# EasyEDA Pro project ProPrj_Usb Hub_2026-05-24.epro

# Schematic Schematic1
Board Name: Board1; Create Date: 2026-05-18; Page Name: P1; Project Name: Usb; Schematic Name: Schematic1; Update Date: 2026-05-18; Company: EasyEDA.com; Page Size: A4; Version: V1.0
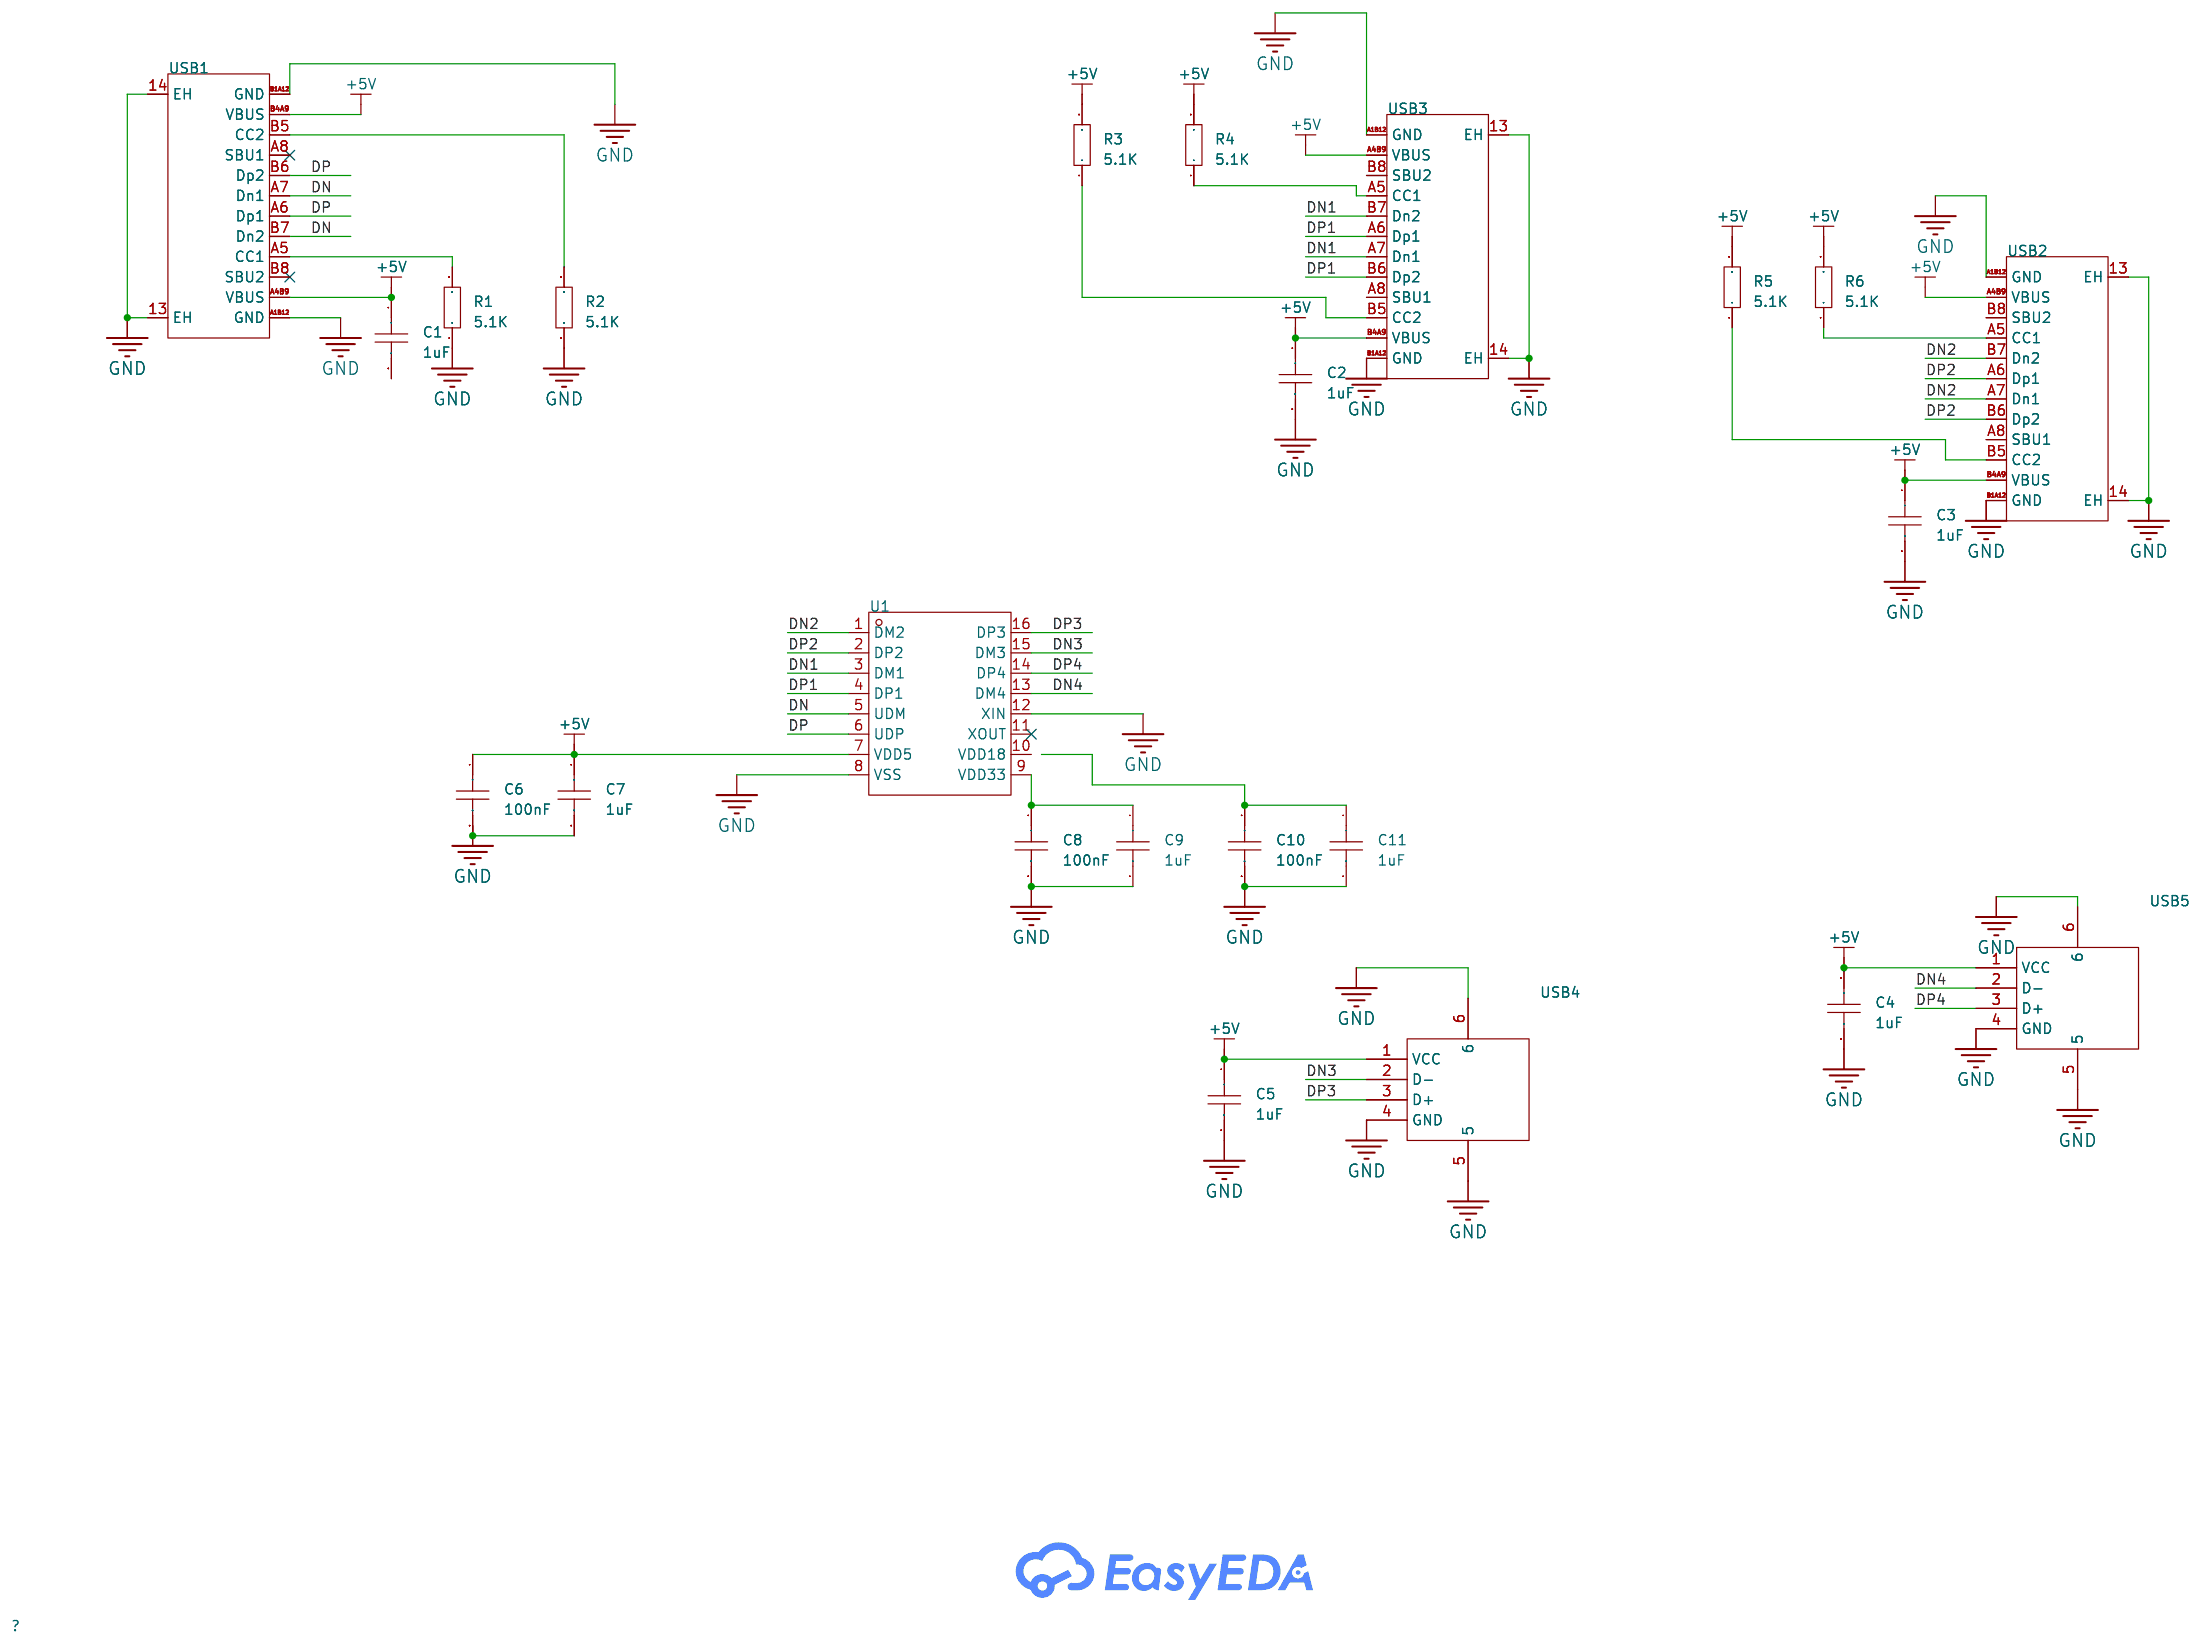
[diagram p0: schematic sheet]

## Parts
C1  1uF  [C0603]
C2  1uF  [C0603]
C3  1uF  [C0603]
C4  1uF  [C0603]
C5  1uF  [C0603]
C6  100nF  [C0603]
C7  1uF  [C0603]
C8  100nF  [C0603]
C9  1uF  [C0603]
C10  100nF  [C0603]
C11  1uF  [C0603]
R1  5.1K  [R0603]
R2  5.1K  [R0603]
R3  5.1K  [R0603]
R4  5.1K  [R0603]
R5  5.1K  [R0603]
R6  5.1K  [R0603]
U1  SL2.1s  [SSOP-16_L4.6-W2.6-P0.53-LS4.0-BL]
USB1  TYPE-C 16PIN 2MD(073)  [USB-C-SMD_TYPE-C-16PIN-2MD-073]
USB2  TYPE-C 16PIN 2MD(073)  [USB-C-SMD_TYPE-C-16PIN-2MD-073]
USB3  TYPE-C 16PIN 2MD(073)  [USB-C-SMD_TYPE-C-16PIN-2MD-073]
USB4  10.0 QHHTZB6.3  [USB-A-TH_10.0QHHTZB6.3]
USB5  10.0 QHHTZB6.3  [USB-A-TH_10.0QHHTZB6.3]

## Library data of the parts
C1-C11 = CAP_0603: Supplier Footprint: 0603
R1-R6 = Res_0603: Supplier Footprint: 0603
U1 = SL2.1s: type:Hub USB Protocol:USB 2.0 Data Rate:- Voltage - Supply:4V~5.25V Voltage - Supply:4V~5.25V Operating Temperature:0℃~+70℃ Operating Temperature:0℃~+70℃ Memory Interface:- Current - Supply:120mA Quiescent Supply Current:2.5mA Number of Channels:4; LCSC Part Name: USB2.0 HUB控制器集成电路; Supplier Part: C2684433; Manufacturer: CoreChips(和芯润德); Supplier Footprint: SSOP-16; JLCPCB Part Class: Extended Part; Datasheet: https://item.szlcsc.com/datasheet/SL2.1s/2782346.html; Supplier: LCSC; type: Hub; USB Protocol: USB 2.0; Voltage - Supply: 4V~5.25V; Operating Temperature: 0℃~+70℃; Current - Supply: 120mA; Quiescent Supply Current: 2.5mA; Number of Channels: 4
USB1-USB3 = TYPE-C 16PIN 2MD(073): Connector Type:Type-C Protocol Standard:- Gender:Female Mounting Type:Surface Mount, Right Angle Number of Contacts:16P Number of Ports:1 Current Rating-Power:3A Voltage Rating:5V Connect-Disconnect Life:10,000 Cycles Supplementary Features:- Center Heigh; LCSC Part Name: Type-C 母 卧贴; Supplier Part: C2765186; Manufacturer: SHOU HAN(首韩); Supplier Footprint: SMD; JLCPCB Part Class: Extended Part; Datasheet: https://item.szlcsc.com/datasheet/TYPE-C%252016PIN%25202MD(073)/2901843.html; Supplier: LCSC; Connector Type: Type-C; Gender: Female; Mounting Type: Surface Mount, Right Angle; Number of Contacts: 16P; Number of Ports: 1; Current Rating-Power: 3A; Voltage Rating: 5V; Connect-Disconnect Life: 10,000 Cycles; Detection color: Black; Operating Temperature: -25℃~+85℃
USB4 USB5 = 10.0 QHHTZB6.3: Connector Type:Type-A Protocol Standard:USB 2.0 Gender:Female Mounting Type:Surface Mount, Right Angle Number of Contacts:4P Number of Ports:1 Current Rating-Power:1.5A Voltage Rating:30V Connect-Disconnect Life:5,000 times Supplementary Features:- Center; LCSC Part Name: 壳长10.0mm; Supplier Part: C668591; Manufacturer: SHOU HAN(首韩); Supplier Footprint: SMD; JLCPCB Part Class: Extended Part; Datasheet: https://item.szlcsc.com/datasheet/10.0%2520QHHTZB6.3/698534.html; Supplier: LCSC; Connector Type: Type-A; Protocol Standard: USB 2.0; Gender: Female; Mounting Type: Surface Mount, Right Angle; Number of Contacts: 4P; Number of Ports: 1; Current Rating-Power: 1.5A; Voltage Rating: 30V; Connect-Disconnect Life: 5,000 times; Length: 10mm; Detection color: Black; Operating Temperature: -25℃~+85℃

## Nets
+5V: C1.1 C2.1 C3.1 C4.1 C5.1 C6.1 C7.1 R3.2 R4.2 R5.2 R6.2 U1.7(VDD5) USB1.A4B9(VBUS) USB1.B4A9(VBUS) USB2.A4B9(VBUS) USB2.B4A9(VBUS) USB3.A4B9(VBUS) USB3.B4A9(VBUS) USB4.1(VCC) USB5.1(VCC)
GND: C2.2 C3.2 C4.2 C5.2 C6.2 C7.2 C8.2 C9.2 C10.2 C11.2 R1.1 R2.1 U1.8(VSS) U1.12(XIN) USB1.13(EH) USB1.14(EH) USB1.A1B12(GND) USB1.B1A12(GND) USB2.13(EH) USB2.14(EH) USB2.A1B12(GND) USB2.B1A12(GND) USB3.13(EH) USB3.14(EH) USB3.A1B12(GND) USB3.B1A12(GND) USB4.4(GND) USB4.5 USB4.6 USB5.4(GND) USB5.5 USB5.6
DN: U1.5(UDM) USB1.A7(Dn1) USB1.B7(Dn2)
DN1: U1.3(DM1) USB3.A7(Dn1) USB3.B7(Dn2)
DN2: U1.1(DM2) USB2.A7(Dn1) USB2.B7(Dn2)
DN3: U1.15(DM3) USB4.2(D-)
DN4: U1.13(DM4) USB5.2(D-)
DP: U1.6(UDP) USB1.A6(Dp1) USB1.B6(Dp2)
DP1: U1.4(DP1) USB3.A6(Dp1) USB3.B6(Dp2)
DP2: U1.2(DP2) USB2.A6(Dp1) USB2.B6(Dp2)
DP3: U1.16(DP3) USB4.3(D+)
DP4: U1.14(DP4) USB5.3(D+)
$1N961: R1.2 USB1.A5(CC1)
$1N966: R2.2 USB1.B5(CC2)
$1N1928: R4.1 USB3.A5(CC1)
$1N1937: R3.1 USB3.B5(CC2)
$1N1945: R6.1 USB2.A5(CC1)
$1N1951: R5.1 USB2.B5(CC2)
$1N2682: C8.1 C9.1 U1.9(VDD33)
$1N2694: C10.1 C11.1

Not connected (* = marked no-connect by the designer): C1 2; U1 10(VDD18) 11(XOUT)*; USB1 A8(SBU1)* B8(SBU2)*; USB2 A8(SBU1) B8(SBU2); USB3 A8(SBU1) B8(SBU2)

# Board PCB1
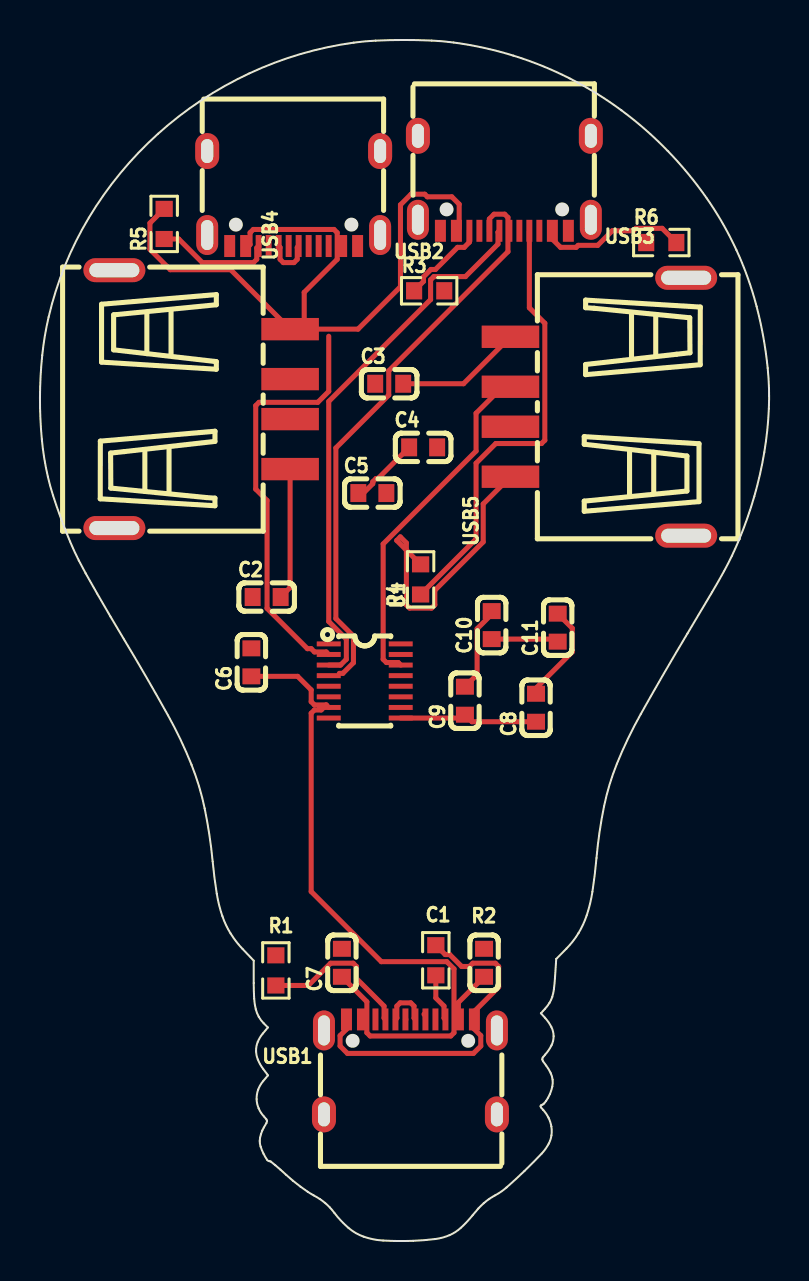
[diagram p1: board, top side]
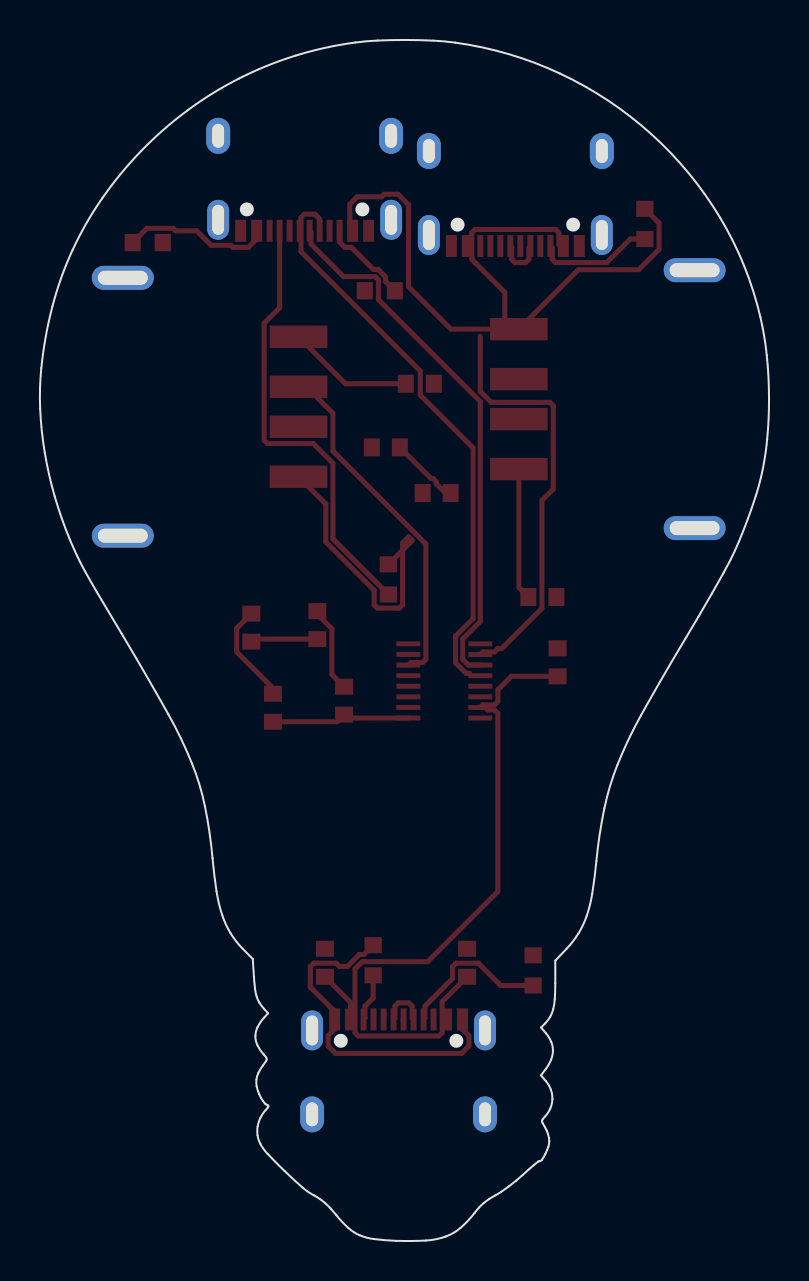
[diagram p2: board, bottom side, seen from below]

Outline 36.47 x 60.07 mm; copper layers: Top Layer, Bottom Layer. Coordinates in mm from the lower left corner of the outline.
Outline path: 0,42.19 arc(0.03,43.25) 0.11,44.3 arc(0.24,45.26) 0.43,46.21 arc(1.25,48.78) 2.45,51.18 arc(4.02,53.41) 5.91,55.38 arc(8.07,57.06) 10.47,58.4 arc(13.02,59.37) 15.69,59.94 arc(16.24,60) 16.79,60.04 arc(17.49,60.07) 18.19,60.07 arc(18.89,60.07) 19.59,60.04 arc(20.14,60.01) 20.69,59.95 arc(22.2,59.68) 23.67,59.29 arc(25.11,58.78) 26.49,58.15 arc(27.82,57.41) 29.09,56.55 arc(30.28,55.59) 31.4,54.53 arc(32.42,53.38) 33.36,52.15 arc(34.15,50.89) 34.84,49.57 arc(35.4,48.18) 35.85,46.75 arc(36.18,45.22) 36.4,43.67 arc(36.47,42.64) 36.46,41.62 arc(36.38,40.53) 36.23,39.45 arc(36.01,38.35) 35.73,37.25 arc(35.38,36.16) 34.97,35.09 arc(34.8,34.68) 34.61,34.27 arc(34.42,33.88) 34.22,33.5 arc(33.92,32.98) 33.62,32.46 arc(33.01,31.42) 32.39,30.39 arc(31.21,28.38) 30.05,26.36 arc(29.42,25.14) 28.86,23.88 arc(28.49,22.83) 28.22,21.74 arc(27.99,20.46) 27.84,19.16 arc(27.75,18.31) 27.63,17.47 arc(27.52,16.88) 27.35,16.29 arc(27.17,15.83) 26.93,15.4 arc(26.66,14.99) 26.33,14.63 25.82,14.11 25.76,13.21 arc(25.74,12.9) 25.71,12.6 arc(25.67,12.4) 25.62,12.21 arc(25.56,12.06) 25.49,11.91 arc(25.38,11.76) 25.26,11.62 25.06,11.39 25.26,11.17 arc(25.44,10.94) 25.58,10.7 arc(25.66,10.48) 25.69,10.24 arc(25.67,10.01) 25.59,9.79 arc(25.44,9.54) 25.27,9.32 arc(25.21,9.25) 25.15,9.18 arc(25.13,9.14) 25.13,9.09 arc(25.14,9.04) 25.16,8.99 arc(25.24,8.88) 25.32,8.77 arc(25.44,8.6) 25.54,8.41 arc(25.6,8.25) 25.64,8.08 arc(25.65,7.9) 25.63,7.73 arc(25.58,7.53) 25.5,7.35 arc(25.46,7.25) 25.41,7.17 arc(25.37,7.08) 25.31,7 arc(25.27,6.94) 25.22,6.88 arc(25.18,6.85) 25.14,6.83 arc(25.1,6.81) 25.06,6.79 arc(25.04,6.77) 25.04,6.74 arc(25.05,6.71) 25.07,6.68 arc(25.12,6.62) 25.17,6.55 arc(25.32,6.37) 25.44,6.17 arc(25.52,5.95) 25.58,5.73 arc(25.6,5.51) 25.58,5.28 arc(25.53,5.07) 25.45,4.87 arc(25.29,4.61) 25.09,4.37 arc(24.67,3.93) 24.24,3.51 arc(23.79,3.09) 23.34,2.68 arc(23.07,2.47) 22.77,2.29 arc(22.62,2.2) 22.47,2.11 arc(22.33,2) 22.2,1.89 arc(22.06,1.76) 21.93,1.63 arc(21.78,1.46) 21.64,1.29 arc(21.36,0.96) 21.05,0.66 arc(20.78,0.45) 20.49,0.29 arc(20.14,0.17) 19.77,0.1 arc(19.22,0.04) 18.67,0.01 arc(17.92,0) 17.17,0.02 arc(16.67,0.09) 16.18,0.22 arc(15.79,0.4) 15.44,0.65 arc(15.06,1.01) 14.72,1.41 arc(14.62,1.55) 14.5,1.68 arc(14.39,1.79) 14.26,1.9 arc(14.13,2.01) 14,2.1 arc(13.84,2.2) 13.69,2.29 arc(13.54,2.37) 13.39,2.46 arc(13.21,2.59) 13.03,2.72 arc(12.83,2.87) 12.65,3.02 arc(12.48,3.16) 12.32,3.31 arc(12.17,3.44) 12.03,3.57 arc(11.9,3.68) 11.77,3.79 arc(11.66,3.88) 11.55,3.97 arc(11.52,3.99) 11.49,3.99 arc(11.42,4.01) 11.36,4.07 arc(11.26,4.22) 11.18,4.37 arc(11.1,4.54) 11.04,4.72 arc(11,4.86) 10.99,5 arc(11,5.08) 11.01,5.16 arc(11.03,5.25) 11.05,5.34 arc(11.08,5.43) 11.12,5.52 arc(11.16,5.6) 11.2,5.68 arc(11.26,5.79) 11.33,5.9 arc(11.35,5.95) 11.35,6 arc(11.35,6.05) 11.32,6.09 arc(11.27,6.16) 11.2,6.23 arc(11.05,6.42) 10.94,6.64 arc(10.87,6.87) 10.84,7.1 arc(10.85,7.34) 10.91,7.57 arc(11.02,7.79) 11.16,8 11.41,8.29 11.16,8.61 arc(11.01,8.84) 10.9,9.07 arc(10.83,9.3) 10.81,9.53 arc(10.83,9.75) 10.9,9.96 arc(11.01,10.18) 11.15,10.38 11.4,10.68 11.19,10.9 arc(11.05,11.05) 10.94,11.22 arc(10.86,11.4) 10.79,11.6 arc(10.74,11.86) 10.71,12.12 arc(10.7,12.51) 10.69,12.9 10.69,14.02 10.14,14.6 arc(9.82,14.98) 9.53,15.39 arc(9.3,15.81) 9.12,16.25 arc(8.96,16.81) 8.84,17.37 arc(8.73,18.18) 8.64,18.99 arc(8.47,20.32) 8.24,21.64 arc(7.96,22.74) 7.58,23.82 arc(7.03,25.08) 6.41,26.29 arc(5.32,28.2) 4.21,30.09 arc(3.87,30.66) 3.53,31.23 arc(3.19,31.81) 2.86,32.39 arc(2.57,32.89) 2.28,33.4 arc(2.11,33.72) 1.94,34.04 arc(1.72,34.51) 1.51,34.98 arc(1.27,35.56) 1.05,36.14 arc(0.85,36.71) 0.65,37.29 arc(0.52,37.75) 0.4,38.23 arc(0.21,39.16) 0.09,40.09 arc(0.02,41.14) 0,42.19
Stack: Top Layer 0.035mm / Dielectric1 1.51mm FR4 er 4.5 / Bottom Layer 0.035mm

## Design rules (mm)
net DN: DP1
net DP: DP1
template: JLCPCB Capability(Two Layers Board)
spacing copperThickness1oz (default): track to track 0.102, other pairs 0.152 to 0.3
spacing copperThickness2oz: track to track 0.203, other pairs 0.152 to 0.3
track width copperThickness1oz (default): min 0.127, default 0.254, max 2.54
track width copperThickness2oz: min 0.203, default 0.254, max 2.54
differential pair differentialPair (default): width min 0.127, default 0.254, max 2.54; gap min 0.152, default 0.152
via viaSize (default): diameter min 0.5, default 0.61, max 10; hole min 0.3, default 0.305, max 6.3

## Placement (name value [footprint] x y rotation side)
C1  1uF  [C0603]  22.21 13.92 90 top
C2  1uF  [C0603]  11.34 32.21 0 top
C3  1uF  [C0603]  17.47 42.88 0 top
C4  1uF  [C0603]  19.17 39.7 0 top
C5  1uF  [C0603]  16.63 37.41 0 top
C6  100nF  [C0603]  10.57 28.94 90 top
C7  1uF  [C0603]  15.1 13.92 90 top
C8  100nF  [C0603]  24.81 26.67 90 top
C9  1uF  [C0603]  21.26 27.03 90 top
C10  100nF  [C0603]  22.59 30.81 90 top
C11  1uF  [C0603]  25.9 30.68 90 top
R1  5.1K  [R0603]  11.8 13.53 270 top
R2  5.1K  [R0603]  19.8 14.04 270 top
R3  5.1K  [R0603]  19.47 47.53 0 top
R4  5.1K  [R0603]  19.04 33.09 90 top
R5  5.1K  [R0603]  6.21 50.87 90 top
R6  5.1K  [R0603]  31.08 49.94 0 top
U1  SL2.1s  [SSOP-16_L4.6-W2.6-P0.53-LS4.0-BL]  16.24 28.01 270 top
USB1  TYPE-C 16PIN 2MD(073)  [USB-C-SMD_TYPE-C-16PIN-2MD-073]  18.53 8.71 0 top
USB2  TYPE-C 16PIN 2MD(073)  [USB-C-SMD_TYPE-C-16PIN-2MD-073]  12.69 52.14 180 top
USB3  TYPE-C 16PIN 2MD(073)  [USB-C-SMD_TYPE-C-16PIN-2MD-073]  23.23 52.9 180 top
USB4  10.0 QHHTZB6.3  [USB-A-TH_10.0QHHTZB6.3]  8.12 42.11 270 top
USB5  10.0 QHHTZB6.3  [USB-A-TH_10.0QHHTZB6.3]  27.93 41.73 90 top

## Footprints (pads in the part's own frame, mm; a bottom-side part is the same pattern mirrored in y, then rotated)
C0603
  rect 0.8x0.9 smd: 1(-0.7,0) 2(0.7,0)
R0603
  rect 0.806x0.864 smd: 1(-0.753,0) 2(0.753,0)
SSOP-16_L4.6-W2.6-P0.53-LS4.0-BL
  rect 0.25x1.2 smd: 1(-1.855,-1.8) 2(-1.325,-1.8) 3(-0.795,-1.8) 4(-0.265,-1.8) 5(0.265,-1.8) 6(0.795,-1.8) 7(1.325,-1.8) 8(1.855,-1.8) 9(1.855,1.8) 10(1.325,1.8) 11(0.795,1.8) 12(0.265,1.8) 13(-0.265,1.8) 14(-0.795,1.8) 15(-1.325,1.8) 16(-1.855,1.8)
USB-A-TH_10.0QHHTZB6.3
  rect 1.12x2.88 smd: 1(-3.5,4.395) 2(-1,4.395) 3(1,4.395) 4(3.5,4.395)
  oval 1.2x3.1 hole 0.7x2.5: 5(-6.45,-4.395) 6(6.45,-4.395)
USB-C-SMD_TYPE-C-16PIN-2MD-073
  oval 1.1x2 hole 0.6x1.5: 13(-4.325,1.825) 14(4.325,1.825)
  oval 1.2x1.8 hole 0.6x1.2: 13(-4.325,-2.375) 14(4.325,-2.375)
  rect 0.55x1.1 smd: A1B12(-3.2,2.375) A4B9(-2.4,2.375) B1A12(3.2,2.375) B4A9(2.4,2.375)
  rect 0.3x1.1 smd: A5(-1.25,2.375) A6(-0.25,2.375) A7(0.25,2.375) A8(1.25,2.375) B5(1.75,2.375) B6(0.75,2.375) B7(-0.75,2.375) B8(-1.75,2.375)

## Nets
As in the schematic.

Pads without a net: C1 2; U1 10 11; USB1 A8 B8; USB2 A8 B8; USB3 A8 B8

## Routing (per net, layer and track width the routed paths; a pad name or vN(x,y) marks a point on that pad's centre or on a via; arc(x,y) is an arc through that point)
+5V: length 100.2
  Top Layer w0.254: R4.2 18.33,34.56 ; 18.33,34.56 17.84,35.04 18.02,35.22 18.33,34.92 18.33,34.56 ; 18.33,34.56 18.33,31.82 18.49,31.66 19.59,31.66 19.75,31.82 19.75,32.55 22.17,34.97 22.17,36.87 USB5.1 ; USB1.B4A9 20.93,11.93 C1.1 ; 13.22,45.61 USB4.1 9.54,48.58 6.52,48.58 5.5,49.6 5.5,50.92 R5.2 ; 13.22,45.61 15.91,45.61 18.03,47.73 18.03,51.83 18.56,52.36 19.25,52.36 19.38,52.23 20.6,52.23 20.97,51.86 20.97,50.67 USB3.B4A9 ; 13.22,45.61 13.22,47.45 14.87,49.1 14.87,50.43 14.7,50.6 10.67,50.6 10.51,50.43 10.51,49.84 10.44,49.77 USB2.B4A9 ; C7.1 16.35,11.97 16.35,10.42 16.51,10.25 20.55,10.25 20.71,10.42 20.71,13.61 20.35,13.97 17.07,13.97 13.57,17.48 13.57,26.4 13.73,26.56 14.07,26.56 14.32,26.81 ; C4.1 16.91,38.14 16.81,38.14 16.65,37.98 16.65,37.88 16.18,37.41 C5.1 ; 14.32,26.81 U1.7 ; 14.32,26.81 13.73,26.81 13.57,26.98 13.57,27.57 12.89,28.24 C6.1 ; USB3.A4B9 25.63,50.11 26.04,49.7 26.82,49.7 26.92,49.8 27.9,49.8 28.63,50.53 29.68,50.53 29.81,50.65 31.12,50.65 R6.2
GND: length 39.5
  Top Layer w0.254: C9.2 21.87,28.33 21.87,30.62 22.59,31.35 C10.2 ; R2.1 20.27,14.33 20.5,14.33 21.09,13.73 21.48,13.73 21.65,13.89 22.78,13.89 22.94,13.73 22.94,12.7 21.73,11.49 21.73,11.08 21.68,11.03 21.68,10.64 22.05,10.27 22.05,9.75 21.68,9.38 15.38,9.38 15.01,9.75 15.01,10.27 15.33,10.59 USB1.A1B12 ; USB4.4 12.51,32.68 C2.2 ; C11.2 26.63,30.65 26.63,29.46 24.81,27.65 C8.2 ; USB5.4 21.18,42.88 C3.2
DN: length 2.4
  Top Layer w0.254: USB1.A7 18.71,11.15 18.71,11.75 18.55,11.91 18.01,11.91 17.85,11.75 17.85,11.15 USB1.B7
DN1: length 27.3
  Top Layer w0.254: USB3.A7 22.91,50.46 22.91,49.86 21.28,48.24 19.7,48.24 19.54,48.08 19.54,47.09 14.44,41.99 14.44,30.99 15.32,30.11 15.32,29.1 15.03,28.81 U1.3
DP: length 0.3
  Top Layer w0.254: USB1.B6 19.28,11.27 19.21,11.34 ; USB1.A6 18.3,11.08
DP1: length 28.8
  Top Layer w0.254: USB3.B6 22.48,51.12 22.71,51.36 23.25,51.36 23.41,51.2 23.41,49.49 17.45,43.52 17.45,42.31 14.8,39.67 14.8,31.13 15.68,30.26 15.68,28.92 15.15,28.39 14.97,28.39
DP2: length 23.5
  Top Layer w0.254: U1.2 14.32,29.46 13.73,29.46 13.57,29.63 13.38,29.63 11.36,31.65 11.36,37.04 10.79,37.61 10.79,41.79 10.96,41.95 13.89,41.95 14.44,42.5 14.44,45.25 ; USB2.B6 12.01,49.7 12.01,49.1 12.17,48.94 12.7,48.94 12.87,49.1 12.87,49.7 USB2.A6
DP4: length 17.5
  Top Layer w0.254: USB5.3 23.14,42.73 21.81,41.4 21.81,39.51 17.17,34.86 17.17,29.1 17.33,28.93 17.92,28.93 U1.14
$1N961: length 7.8
  Top Layer w0.254: R1.2 13.42,12.78 14.54,13.89 15.67,13.89 15.83,13.73 15.83,13.13 17.21,11.75 17.21,11.15 USB1.A5
$1N966: length 2.4
  Top Layer w0.254: R2.2 19.8,12.16 20.21,11.75 20.21,11.15 USB1.B5
$1N1928: length 22.4
  Top Layer w0.254: USB3.A5 24.48,46.68 25.25,45.9 25.25,40.05 25.09,39.89 22.8,39.89 21.81,38.9 21.81,35.12 R4.1
$1N1937: length 4.5
  Top Layer w0.254: USB3.B5 21.48,49.96 21.22,49.7 20.89,49.7 19.78,48.6 19.55,48.6 19.18,48.22 19.18,48 R3.1
$1N1951: length 5.9
  Top Layer w0.254: USB2.B5 10.84,49.67 10.84,49.1 10.68,48.94 8.12,48.94 6.94,50.12 R5.1
$1N2682: length 7
  Top Layer w0.254: C8.1 21.61,25.97 C9.1 21.09,26.16 18.04,26.16
$1N2694: length 3.4
  Top Layer w0.254: C11.1 25.77,30.11 C10.1
